# Altium project DUTBoard.PrjPcb (part 5 of 5)
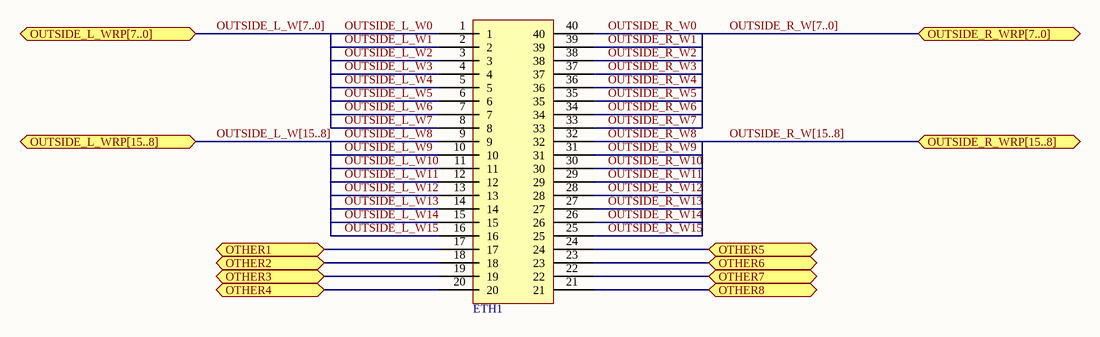
[diagram p15: BOTTOM_HEADER_WRP.SchDoc]

## Nets that join several sheets (continued)
OUTSIDE_L_W6: U_HEADER_BANK/U_COMBINED_HEADER_WRP/U_TOP_HEADER_WRP (TH2.7), U_HEADER_BANK/U_COMBINED_HEADER_WRP/U_BOTTOM_HEADER_WRP (ETH1_U_BOTTOM_HEADER_WRP1.7)
OUTSIDE_L_W7: U_HEADER_BANK/U_COMBINED_HEADER_WRP/U_TOP_HEADER_WRP (TH8.8), U_HEADER_BANK/U_COMBINED_HEADER_WRP/U_BOTTOM_HEADER_WRP (ETH1_U_BOTTOM_HEADER_WRP4.8)
OUTSIDE_L_W7: U_HEADER_BANK/U_COMBINED_HEADER_WRP/U_TOP_HEADER_WRP (TH6.8), U_HEADER_BANK/U_COMBINED_HEADER_WRP/U_BOTTOM_HEADER_WRP (ETH1_U_BOTTOM_HEADER_WRP3.8)
OUTSIDE_L_W7: U_HEADER_BANK/U_COMBINED_HEADER_WRP/U_TOP_HEADER_WRP (TH4.8), U_HEADER_BANK/U_COMBINED_HEADER_WRP/U_BOTTOM_HEADER_WRP (ETH1_U_BOTTOM_HEADER_WRP2.8)
OUTSIDE_L_W7: U_HEADER_BANK/U_COMBINED_HEADER_WRP/U_TOP_HEADER_WRP (TH2.8), U_HEADER_BANK/U_COMBINED_HEADER_WRP/U_BOTTOM_HEADER_WRP (ETH1_U_BOTTOM_HEADER_WRP1.8)
OUTSIDE_L_W8: U_HEADER_BANK/U_COMBINED_HEADER_WRP/U_TOP_HEADER_WRP (TH8.9), U_HEADER_BANK/U_COMBINED_HEADER_WRP/U_BOTTOM_HEADER_WRP (ETH1_U_BOTTOM_HEADER_WRP4.9)
OUTSIDE_L_W8: U_HEADER_BANK/U_COMBINED_HEADER_WRP/U_TOP_HEADER_WRP (TH6.9), U_HEADER_BANK/U_COMBINED_HEADER_WRP/U_BOTTOM_HEADER_WRP (ETH1_U_BOTTOM_HEADER_WRP3.9)
OUTSIDE_L_W8: U_HEADER_BANK/U_COMBINED_HEADER_WRP/U_TOP_HEADER_WRP (TH4.9), U_HEADER_BANK/U_COMBINED_HEADER_WRP/U_BOTTOM_HEADER_WRP (ETH1_U_BOTTOM_HEADER_WRP2.9)
OUTSIDE_L_W8: U_HEADER_BANK/U_COMBINED_HEADER_WRP/U_TOP_HEADER_WRP (TH2.9), U_HEADER_BANK/U_COMBINED_HEADER_WRP/U_BOTTOM_HEADER_WRP (ETH1_U_BOTTOM_HEADER_WRP1.9)
OUTSIDE_L_W9: U_HEADER_BANK/U_COMBINED_HEADER_WRP/U_TOP_HEADER_WRP (TH8.10), U_HEADER_BANK/U_COMBINED_HEADER_WRP/U_BOTTOM_HEADER_WRP (ETH1_U_BOTTOM_HEADER_WRP4.10)
OUTSIDE_L_W9: U_HEADER_BANK/U_COMBINED_HEADER_WRP/U_TOP_HEADER_WRP (TH6.10), U_HEADER_BANK/U_COMBINED_HEADER_WRP/U_BOTTOM_HEADER_WRP (ETH1_U_BOTTOM_HEADER_WRP3.10)
OUTSIDE_L_W9: U_HEADER_BANK/U_COMBINED_HEADER_WRP/U_TOP_HEADER_WRP (TH4.10), U_HEADER_BANK/U_COMBINED_HEADER_WRP/U_BOTTOM_HEADER_WRP (ETH1_U_BOTTOM_HEADER_WRP2.10)
OUTSIDE_L_W9: U_HEADER_BANK/U_COMBINED_HEADER_WRP/U_TOP_HEADER_WRP (TH2.10), U_HEADER_BANK/U_COMBINED_HEADER_WRP/U_BOTTOM_HEADER_WRP (ETH1_U_BOTTOM_HEADER_WRP1.10)
OUTSIDE_L_W10: U_HEADER_BANK/U_COMBINED_HEADER_WRP/U_TOP_HEADER_WRP (TH8.11), U_HEADER_BANK/U_COMBINED_HEADER_WRP/U_BOTTOM_HEADER_WRP (ETH1_U_BOTTOM_HEADER_WRP4.11)
OUTSIDE_L_W10: U_HEADER_BANK/U_COMBINED_HEADER_WRP/U_TOP_HEADER_WRP (TH6.11), U_HEADER_BANK/U_COMBINED_HEADER_WRP/U_BOTTOM_HEADER_WRP (ETH1_U_BOTTOM_HEADER_WRP3.11)
OUTSIDE_L_W10: U_HEADER_BANK/U_COMBINED_HEADER_WRP/U_TOP_HEADER_WRP (TH4.11), U_HEADER_BANK/U_COMBINED_HEADER_WRP/U_BOTTOM_HEADER_WRP (ETH1_U_BOTTOM_HEADER_WRP2.11)
OUTSIDE_L_W10: U_HEADER_BANK/U_COMBINED_HEADER_WRP/U_TOP_HEADER_WRP (TH2.11), U_HEADER_BANK/U_COMBINED_HEADER_WRP/U_BOTTOM_HEADER_WRP (ETH1_U_BOTTOM_HEADER_WRP1.11)
OUTSIDE_L_W11: U_HEADER_BANK/U_COMBINED_HEADER_WRP/U_TOP_HEADER_WRP (TH8.12), U_HEADER_BANK/U_COMBINED_HEADER_WRP/U_BOTTOM_HEADER_WRP (ETH1_U_BOTTOM_HEADER_WRP4.12)
OUTSIDE_L_W11: U_HEADER_BANK/U_COMBINED_HEADER_WRP/U_TOP_HEADER_WRP (TH6.12), U_HEADER_BANK/U_COMBINED_HEADER_WRP/U_BOTTOM_HEADER_WRP (ETH1_U_BOTTOM_HEADER_WRP3.12)
OUTSIDE_L_W11: U_HEADER_BANK/U_COMBINED_HEADER_WRP/U_TOP_HEADER_WRP (TH4.12), U_HEADER_BANK/U_COMBINED_HEADER_WRP/U_BOTTOM_HEADER_WRP (ETH1_U_BOTTOM_HEADER_WRP2.12)
OUTSIDE_L_W11: U_HEADER_BANK/U_COMBINED_HEADER_WRP/U_TOP_HEADER_WRP (TH2.12), U_HEADER_BANK/U_COMBINED_HEADER_WRP/U_BOTTOM_HEADER_WRP (ETH1_U_BOTTOM_HEADER_WRP1.12)
OUTSIDE_L_W12: U_HEADER_BANK/U_COMBINED_HEADER_WRP/U_TOP_HEADER_WRP (TH8.13), U_HEADER_BANK/U_COMBINED_HEADER_WRP/U_BOTTOM_HEADER_WRP (ETH1_U_BOTTOM_HEADER_WRP4.13)
OUTSIDE_L_W12: U_HEADER_BANK/U_COMBINED_HEADER_WRP/U_TOP_HEADER_WRP (TH6.13), U_HEADER_BANK/U_COMBINED_HEADER_WRP/U_BOTTOM_HEADER_WRP (ETH1_U_BOTTOM_HEADER_WRP3.13)
OUTSIDE_L_W12: U_HEADER_BANK/U_COMBINED_HEADER_WRP/U_TOP_HEADER_WRP (TH4.13), U_HEADER_BANK/U_COMBINED_HEADER_WRP/U_BOTTOM_HEADER_WRP (ETH1_U_BOTTOM_HEADER_WRP2.13)
OUTSIDE_L_W12: U_HEADER_BANK/U_COMBINED_HEADER_WRP/U_TOP_HEADER_WRP (TH2.13), U_HEADER_BANK/U_COMBINED_HEADER_WRP/U_BOTTOM_HEADER_WRP (ETH1_U_BOTTOM_HEADER_WRP1.13)
OUTSIDE_L_W13: U_HEADER_BANK/U_COMBINED_HEADER_WRP/U_TOP_HEADER_WRP (TH8.14), U_HEADER_BANK/U_COMBINED_HEADER_WRP/U_BOTTOM_HEADER_WRP (ETH1_U_BOTTOM_HEADER_WRP4.14)
OUTSIDE_L_W13: U_HEADER_BANK/U_COMBINED_HEADER_WRP/U_TOP_HEADER_WRP (TH6.14), U_HEADER_BANK/U_COMBINED_HEADER_WRP/U_BOTTOM_HEADER_WRP (ETH1_U_BOTTOM_HEADER_WRP3.14)
OUTSIDE_L_W13: U_HEADER_BANK/U_COMBINED_HEADER_WRP/U_TOP_HEADER_WRP (TH4.14), U_HEADER_BANK/U_COMBINED_HEADER_WRP/U_BOTTOM_HEADER_WRP (ETH1_U_BOTTOM_HEADER_WRP2.14)
OUTSIDE_L_W13: U_HEADER_BANK/U_COMBINED_HEADER_WRP/U_TOP_HEADER_WRP (TH2.14), U_HEADER_BANK/U_COMBINED_HEADER_WRP/U_BOTTOM_HEADER_WRP (ETH1_U_BOTTOM_HEADER_WRP1.14)
OUTSIDE_L_W14: U_HEADER_BANK/U_COMBINED_HEADER_WRP/U_TOP_HEADER_WRP (TH8.15), U_HEADER_BANK/U_COMBINED_HEADER_WRP/U_BOTTOM_HEADER_WRP (ETH1_U_BOTTOM_HEADER_WRP4.15)
OUTSIDE_L_W14: U_HEADER_BANK/U_COMBINED_HEADER_WRP/U_TOP_HEADER_WRP (TH6.15), U_HEADER_BANK/U_COMBINED_HEADER_WRP/U_BOTTOM_HEADER_WRP (ETH1_U_BOTTOM_HEADER_WRP3.15)
OUTSIDE_L_W14: U_HEADER_BANK/U_COMBINED_HEADER_WRP/U_TOP_HEADER_WRP (TH4.15), U_HEADER_BANK/U_COMBINED_HEADER_WRP/U_BOTTOM_HEADER_WRP (ETH1_U_BOTTOM_HEADER_WRP2.15)
OUTSIDE_L_W14: U_HEADER_BANK/U_COMBINED_HEADER_WRP/U_TOP_HEADER_WRP (TH2.15), U_HEADER_BANK/U_COMBINED_HEADER_WRP/U_BOTTOM_HEADER_WRP (ETH1_U_BOTTOM_HEADER_WRP1.15)
OUTSIDE_L_W15: U_HEADER_BANK/U_COMBINED_HEADER_WRP/U_TOP_HEADER_WRP (TH8.16), U_HEADER_BANK/U_COMBINED_HEADER_WRP/U_BOTTOM_HEADER_WRP (ETH1_U_BOTTOM_HEADER_WRP4.16)
OUTSIDE_L_W15: U_HEADER_BANK/U_COMBINED_HEADER_WRP/U_TOP_HEADER_WRP (TH6.16), U_HEADER_BANK/U_COMBINED_HEADER_WRP/U_BOTTOM_HEADER_WRP (ETH1_U_BOTTOM_HEADER_WRP3.16)
OUTSIDE_L_W15: U_HEADER_BANK/U_COMBINED_HEADER_WRP/U_TOP_HEADER_WRP (TH4.16), U_HEADER_BANK/U_COMBINED_HEADER_WRP/U_BOTTOM_HEADER_WRP (ETH1_U_BOTTOM_HEADER_WRP2.16)
OUTSIDE_L_W15: U_HEADER_BANK/U_COMBINED_HEADER_WRP/U_TOP_HEADER_WRP (TH2.16), U_HEADER_BANK/U_COMBINED_HEADER_WRP/U_BOTTOM_HEADER_WRP (ETH1_U_BOTTOM_HEADER_WRP1.16)
OUTSIDE_R_W0: U_HEADER_BANK/U_COMBINED_HEADER_WRP/U_TOP_HEADER_WRP (TH7.1), U_HEADER_BANK/U_COMBINED_HEADER_WRP/U_BOTTOM_HEADER_WRP (ETH1_U_BOTTOM_HEADER_WRP4.40)
OUTSIDE_R_W0: U_HEADER_BANK/U_COMBINED_HEADER_WRP/U_TOP_HEADER_WRP (TH5.1), U_HEADER_BANK/U_COMBINED_HEADER_WRP/U_BOTTOM_HEADER_WRP (ETH1_U_BOTTOM_HEADER_WRP3.40)
OUTSIDE_R_W0: U_HEADER_BANK/U_COMBINED_HEADER_WRP/U_TOP_HEADER_WRP (TH3#1.1), U_HEADER_BANK/U_COMBINED_HEADER_WRP/U_BOTTOM_HEADER_WRP (ETH1_U_BOTTOM_HEADER_WRP2.40)
OUTSIDE_R_W0: U_HEADER_BANK/U_COMBINED_HEADER_WRP/U_TOP_HEADER_WRP (TH3#2.1), U_HEADER_BANK/U_COMBINED_HEADER_WRP/U_BOTTOM_HEADER_WRP (ETH1_U_BOTTOM_HEADER_WRP1.40)
OUTSIDE_R_W1: U_HEADER_BANK/U_COMBINED_HEADER_WRP/U_TOP_HEADER_WRP (TH7.2), U_HEADER_BANK/U_COMBINED_HEADER_WRP/U_BOTTOM_HEADER_WRP (ETH1_U_BOTTOM_HEADER_WRP4.39)
OUTSIDE_R_W1: U_HEADER_BANK/U_COMBINED_HEADER_WRP/U_TOP_HEADER_WRP (TH5.2), U_HEADER_BANK/U_COMBINED_HEADER_WRP/U_BOTTOM_HEADER_WRP (ETH1_U_BOTTOM_HEADER_WRP3.39)
OUTSIDE_R_W1: U_HEADER_BANK/U_COMBINED_HEADER_WRP/U_TOP_HEADER_WRP (TH3#1.2), U_HEADER_BANK/U_COMBINED_HEADER_WRP/U_BOTTOM_HEADER_WRP (ETH1_U_BOTTOM_HEADER_WRP2.39)
OUTSIDE_R_W1: U_HEADER_BANK/U_COMBINED_HEADER_WRP/U_TOP_HEADER_WRP (TH3#2.2), U_HEADER_BANK/U_COMBINED_HEADER_WRP/U_BOTTOM_HEADER_WRP (ETH1_U_BOTTOM_HEADER_WRP1.39)
OUTSIDE_R_W2: U_HEADER_BANK/U_COMBINED_HEADER_WRP/U_TOP_HEADER_WRP (TH7.3), U_HEADER_BANK/U_COMBINED_HEADER_WRP/U_BOTTOM_HEADER_WRP (ETH1_U_BOTTOM_HEADER_WRP4.38)
OUTSIDE_R_W2: U_HEADER_BANK/U_COMBINED_HEADER_WRP/U_TOP_HEADER_WRP (TH5.3), U_HEADER_BANK/U_COMBINED_HEADER_WRP/U_BOTTOM_HEADER_WRP (ETH1_U_BOTTOM_HEADER_WRP3.38)
OUTSIDE_R_W2: U_HEADER_BANK/U_COMBINED_HEADER_WRP/U_TOP_HEADER_WRP (TH3#1.3), U_HEADER_BANK/U_COMBINED_HEADER_WRP/U_BOTTOM_HEADER_WRP (ETH1_U_BOTTOM_HEADER_WRP2.38)
OUTSIDE_R_W2: U_HEADER_BANK/U_COMBINED_HEADER_WRP/U_TOP_HEADER_WRP (TH3#2.3), U_HEADER_BANK/U_COMBINED_HEADER_WRP/U_BOTTOM_HEADER_WRP (ETH1_U_BOTTOM_HEADER_WRP1.38)
OUTSIDE_R_W3: U_HEADER_BANK/U_COMBINED_HEADER_WRP/U_TOP_HEADER_WRP (TH7.4), U_HEADER_BANK/U_COMBINED_HEADER_WRP/U_BOTTOM_HEADER_WRP (ETH1_U_BOTTOM_HEADER_WRP4.37)
OUTSIDE_R_W3: U_HEADER_BANK/U_COMBINED_HEADER_WRP/U_TOP_HEADER_WRP (TH5.4), U_HEADER_BANK/U_COMBINED_HEADER_WRP/U_BOTTOM_HEADER_WRP (ETH1_U_BOTTOM_HEADER_WRP3.37)
OUTSIDE_R_W3: U_HEADER_BANK/U_COMBINED_HEADER_WRP/U_TOP_HEADER_WRP (TH3#1.4), U_HEADER_BANK/U_COMBINED_HEADER_WRP/U_BOTTOM_HEADER_WRP (ETH1_U_BOTTOM_HEADER_WRP2.37)
OUTSIDE_R_W3: U_HEADER_BANK/U_COMBINED_HEADER_WRP/U_TOP_HEADER_WRP (TH3#2.4), U_HEADER_BANK/U_COMBINED_HEADER_WRP/U_BOTTOM_HEADER_WRP (ETH1_U_BOTTOM_HEADER_WRP1.37)
OUTSIDE_R_W4: U_HEADER_BANK/U_COMBINED_HEADER_WRP/U_TOP_HEADER_WRP (TH7.5), U_HEADER_BANK/U_COMBINED_HEADER_WRP/U_BOTTOM_HEADER_WRP (ETH1_U_BOTTOM_HEADER_WRP4.36)
OUTSIDE_R_W4: U_HEADER_BANK/U_COMBINED_HEADER_WRP/U_TOP_HEADER_WRP (TH5.5), U_HEADER_BANK/U_COMBINED_HEADER_WRP/U_BOTTOM_HEADER_WRP (ETH1_U_BOTTOM_HEADER_WRP3.36)
OUTSIDE_R_W4: U_HEADER_BANK/U_COMBINED_HEADER_WRP/U_TOP_HEADER_WRP (TH3#1.5), U_HEADER_BANK/U_COMBINED_HEADER_WRP/U_BOTTOM_HEADER_WRP (ETH1_U_BOTTOM_HEADER_WRP2.36)
OUTSIDE_R_W4: U_HEADER_BANK/U_COMBINED_HEADER_WRP/U_TOP_HEADER_WRP (TH3#2.5), U_HEADER_BANK/U_COMBINED_HEADER_WRP/U_BOTTOM_HEADER_WRP (ETH1_U_BOTTOM_HEADER_WRP1.36)
OUTSIDE_R_W5: U_HEADER_BANK/U_COMBINED_HEADER_WRP/U_TOP_HEADER_WRP (TH7.6), U_HEADER_BANK/U_COMBINED_HEADER_WRP/U_BOTTOM_HEADER_WRP (ETH1_U_BOTTOM_HEADER_WRP4.35)
OUTSIDE_R_W5: U_HEADER_BANK/U_COMBINED_HEADER_WRP/U_TOP_HEADER_WRP (TH5.6), U_HEADER_BANK/U_COMBINED_HEADER_WRP/U_BOTTOM_HEADER_WRP (ETH1_U_BOTTOM_HEADER_WRP3.35)
OUTSIDE_R_W5: U_HEADER_BANK/U_COMBINED_HEADER_WRP/U_TOP_HEADER_WRP (TH3#1.6), U_HEADER_BANK/U_COMBINED_HEADER_WRP/U_BOTTOM_HEADER_WRP (ETH1_U_BOTTOM_HEADER_WRP2.35)
OUTSIDE_R_W5: U_HEADER_BANK/U_COMBINED_HEADER_WRP/U_TOP_HEADER_WRP (TH3#2.6), U_HEADER_BANK/U_COMBINED_HEADER_WRP/U_BOTTOM_HEADER_WRP (ETH1_U_BOTTOM_HEADER_WRP1.35)
OUTSIDE_R_W6: U_HEADER_BANK/U_COMBINED_HEADER_WRP/U_TOP_HEADER_WRP (TH7.7), U_HEADER_BANK/U_COMBINED_HEADER_WRP/U_BOTTOM_HEADER_WRP (ETH1_U_BOTTOM_HEADER_WRP4.34)
OUTSIDE_R_W6: U_HEADER_BANK/U_COMBINED_HEADER_WRP/U_TOP_HEADER_WRP (TH5.7), U_HEADER_BANK/U_COMBINED_HEADER_WRP/U_BOTTOM_HEADER_WRP (ETH1_U_BOTTOM_HEADER_WRP3.34)
OUTSIDE_R_W6: U_HEADER_BANK/U_COMBINED_HEADER_WRP/U_TOP_HEADER_WRP (TH3#1.7), U_HEADER_BANK/U_COMBINED_HEADER_WRP/U_BOTTOM_HEADER_WRP (ETH1_U_BOTTOM_HEADER_WRP2.34)
OUTSIDE_R_W6: U_HEADER_BANK/U_COMBINED_HEADER_WRP/U_TOP_HEADER_WRP (TH3#2.7), U_HEADER_BANK/U_COMBINED_HEADER_WRP/U_BOTTOM_HEADER_WRP (ETH1_U_BOTTOM_HEADER_WRP1.34)
OUTSIDE_R_W7: U_HEADER_BANK/U_COMBINED_HEADER_WRP/U_TOP_HEADER_WRP (TH7.8), U_HEADER_BANK/U_COMBINED_HEADER_WRP/U_BOTTOM_HEADER_WRP (ETH1_U_BOTTOM_HEADER_WRP4.33)
OUTSIDE_R_W7: U_HEADER_BANK/U_COMBINED_HEADER_WRP/U_TOP_HEADER_WRP (TH5.8), U_HEADER_BANK/U_COMBINED_HEADER_WRP/U_BOTTOM_HEADER_WRP (ETH1_U_BOTTOM_HEADER_WRP3.33)
OUTSIDE_R_W7: U_HEADER_BANK/U_COMBINED_HEADER_WRP/U_TOP_HEADER_WRP (TH3#1.8), U_HEADER_BANK/U_COMBINED_HEADER_WRP/U_BOTTOM_HEADER_WRP (ETH1_U_BOTTOM_HEADER_WRP2.33)
OUTSIDE_R_W7: U_HEADER_BANK/U_COMBINED_HEADER_WRP/U_TOP_HEADER_WRP (TH3#2.8), U_HEADER_BANK/U_COMBINED_HEADER_WRP/U_BOTTOM_HEADER_WRP (ETH1_U_BOTTOM_HEADER_WRP1.33)
OUTSIDE_R_W8: U_HEADER_BANK/U_COMBINED_HEADER_WRP/U_TOP_HEADER_WRP (TH7.9), U_HEADER_BANK/U_COMBINED_HEADER_WRP/U_BOTTOM_HEADER_WRP (ETH1_U_BOTTOM_HEADER_WRP4.32)
OUTSIDE_R_W8: U_HEADER_BANK/U_COMBINED_HEADER_WRP/U_TOP_HEADER_WRP (TH5.9), U_HEADER_BANK/U_COMBINED_HEADER_WRP/U_BOTTOM_HEADER_WRP (ETH1_U_BOTTOM_HEADER_WRP3.32)
OUTSIDE_R_W8: U_HEADER_BANK/U_COMBINED_HEADER_WRP/U_TOP_HEADER_WRP (TH3#1.9), U_HEADER_BANK/U_COMBINED_HEADER_WRP/U_BOTTOM_HEADER_WRP (ETH1_U_BOTTOM_HEADER_WRP2.32)
OUTSIDE_R_W8: U_HEADER_BANK/U_COMBINED_HEADER_WRP/U_TOP_HEADER_WRP (TH3#2.9), U_HEADER_BANK/U_COMBINED_HEADER_WRP/U_BOTTOM_HEADER_WRP (ETH1_U_BOTTOM_HEADER_WRP1.32)
OUTSIDE_R_W9: U_HEADER_BANK/U_COMBINED_HEADER_WRP/U_TOP_HEADER_WRP (TH7.10), U_HEADER_BANK/U_COMBINED_HEADER_WRP/U_BOTTOM_HEADER_WRP (ETH1_U_BOTTOM_HEADER_WRP4.31)
OUTSIDE_R_W9: U_HEADER_BANK/U_COMBINED_HEADER_WRP/U_TOP_HEADER_WRP (TH5.10), U_HEADER_BANK/U_COMBINED_HEADER_WRP/U_BOTTOM_HEADER_WRP (ETH1_U_BOTTOM_HEADER_WRP3.31)
OUTSIDE_R_W9: U_HEADER_BANK/U_COMBINED_HEADER_WRP/U_TOP_HEADER_WRP (TH3#1.10), U_HEADER_BANK/U_COMBINED_HEADER_WRP/U_BOTTOM_HEADER_WRP (ETH1_U_BOTTOM_HEADER_WRP2.31)
OUTSIDE_R_W9: U_HEADER_BANK/U_COMBINED_HEADER_WRP/U_TOP_HEADER_WRP (TH3#2.10), U_HEADER_BANK/U_COMBINED_HEADER_WRP/U_BOTTOM_HEADER_WRP (ETH1_U_BOTTOM_HEADER_WRP1.31)
OUTSIDE_R_W10: U_HEADER_BANK/U_COMBINED_HEADER_WRP/U_TOP_HEADER_WRP (TH7.11), U_HEADER_BANK/U_COMBINED_HEADER_WRP/U_BOTTOM_HEADER_WRP (ETH1_U_BOTTOM_HEADER_WRP4.30)
OUTSIDE_R_W10: U_HEADER_BANK/U_COMBINED_HEADER_WRP/U_TOP_HEADER_WRP (TH5.11), U_HEADER_BANK/U_COMBINED_HEADER_WRP/U_BOTTOM_HEADER_WRP (ETH1_U_BOTTOM_HEADER_WRP3.30)
OUTSIDE_R_W10: U_HEADER_BANK/U_COMBINED_HEADER_WRP/U_TOP_HEADER_WRP (TH3#1.11), U_HEADER_BANK/U_COMBINED_HEADER_WRP/U_BOTTOM_HEADER_WRP (ETH1_U_BOTTOM_HEADER_WRP2.30)
OUTSIDE_R_W10: U_HEADER_BANK/U_COMBINED_HEADER_WRP/U_TOP_HEADER_WRP (TH3#2.11), U_HEADER_BANK/U_COMBINED_HEADER_WRP/U_BOTTOM_HEADER_WRP (ETH1_U_BOTTOM_HEADER_WRP1.30)
OUTSIDE_R_W11: U_HEADER_BANK/U_COMBINED_HEADER_WRP/U_TOP_HEADER_WRP (TH7.12), U_HEADER_BANK/U_COMBINED_HEADER_WRP/U_BOTTOM_HEADER_WRP (ETH1_U_BOTTOM_HEADER_WRP4.29)
OUTSIDE_R_W11: U_HEADER_BANK/U_COMBINED_HEADER_WRP/U_TOP_HEADER_WRP (TH5.12), U_HEADER_BANK/U_COMBINED_HEADER_WRP/U_BOTTOM_HEADER_WRP (ETH1_U_BOTTOM_HEADER_WRP3.29)
OUTSIDE_R_W11: U_HEADER_BANK/U_COMBINED_HEADER_WRP/U_TOP_HEADER_WRP (TH3#1.12), U_HEADER_BANK/U_COMBINED_HEADER_WRP/U_BOTTOM_HEADER_WRP (ETH1_U_BOTTOM_HEADER_WRP2.29)
OUTSIDE_R_W11: U_HEADER_BANK/U_COMBINED_HEADER_WRP/U_TOP_HEADER_WRP (TH3#2.12), U_HEADER_BANK/U_COMBINED_HEADER_WRP/U_BOTTOM_HEADER_WRP (ETH1_U_BOTTOM_HEADER_WRP1.29)
OUTSIDE_R_W12: U_HEADER_BANK/U_COMBINED_HEADER_WRP/U_TOP_HEADER_WRP (TH7.13), U_HEADER_BANK/U_COMBINED_HEADER_WRP/U_BOTTOM_HEADER_WRP (ETH1_U_BOTTOM_HEADER_WRP4.28)
OUTSIDE_R_W12: U_HEADER_BANK/U_COMBINED_HEADER_WRP/U_TOP_HEADER_WRP (TH5.13), U_HEADER_BANK/U_COMBINED_HEADER_WRP/U_BOTTOM_HEADER_WRP (ETH1_U_BOTTOM_HEADER_WRP3.28)
OUTSIDE_R_W12: U_HEADER_BANK/U_COMBINED_HEADER_WRP/U_TOP_HEADER_WRP (TH3#1.13), U_HEADER_BANK/U_COMBINED_HEADER_WRP/U_BOTTOM_HEADER_WRP (ETH1_U_BOTTOM_HEADER_WRP2.28)
OUTSIDE_R_W12: U_HEADER_BANK/U_COMBINED_HEADER_WRP/U_TOP_HEADER_WRP (TH3#2.13), U_HEADER_BANK/U_COMBINED_HEADER_WRP/U_BOTTOM_HEADER_WRP (ETH1_U_BOTTOM_HEADER_WRP1.28)
OUTSIDE_R_W13: U_HEADER_BANK/U_COMBINED_HEADER_WRP/U_TOP_HEADER_WRP (TH7.14), U_HEADER_BANK/U_COMBINED_HEADER_WRP/U_BOTTOM_HEADER_WRP (ETH1_U_BOTTOM_HEADER_WRP4.27)
OUTSIDE_R_W13: U_HEADER_BANK/U_COMBINED_HEADER_WRP/U_TOP_HEADER_WRP (TH5.14), U_HEADER_BANK/U_COMBINED_HEADER_WRP/U_BOTTOM_HEADER_WRP (ETH1_U_BOTTOM_HEADER_WRP3.27)
OUTSIDE_R_W13: U_HEADER_BANK/U_COMBINED_HEADER_WRP/U_TOP_HEADER_WRP (TH3#1.14), U_HEADER_BANK/U_COMBINED_HEADER_WRP/U_BOTTOM_HEADER_WRP (ETH1_U_BOTTOM_HEADER_WRP2.27)
OUTSIDE_R_W13: U_HEADER_BANK/U_COMBINED_HEADER_WRP/U_TOP_HEADER_WRP (TH3#2.14), U_HEADER_BANK/U_COMBINED_HEADER_WRP/U_BOTTOM_HEADER_WRP (ETH1_U_BOTTOM_HEADER_WRP1.27)
OUTSIDE_R_W14: U_HEADER_BANK/U_COMBINED_HEADER_WRP/U_TOP_HEADER_WRP (TH7.15), U_HEADER_BANK/U_COMBINED_HEADER_WRP/U_BOTTOM_HEADER_WRP (ETH1_U_BOTTOM_HEADER_WRP4.26)
OUTSIDE_R_W14: U_HEADER_BANK/U_COMBINED_HEADER_WRP/U_TOP_HEADER_WRP (TH5.15), U_HEADER_BANK/U_COMBINED_HEADER_WRP/U_BOTTOM_HEADER_WRP (ETH1_U_BOTTOM_HEADER_WRP3.26)
OUTSIDE_R_W14: U_HEADER_BANK/U_COMBINED_HEADER_WRP/U_TOP_HEADER_WRP (TH3#1.15), U_HEADER_BANK/U_COMBINED_HEADER_WRP/U_BOTTOM_HEADER_WRP (ETH1_U_BOTTOM_HEADER_WRP2.26)
OUTSIDE_R_W14: U_HEADER_BANK/U_COMBINED_HEADER_WRP/U_TOP_HEADER_WRP (TH3#2.15), U_HEADER_BANK/U_COMBINED_HEADER_WRP/U_BOTTOM_HEADER_WRP (ETH1_U_BOTTOM_HEADER_WRP1.26)
OUTSIDE_R_W15: U_HEADER_BANK/U_COMBINED_HEADER_WRP/U_TOP_HEADER_WRP (TH7.16), U_HEADER_BANK/U_COMBINED_HEADER_WRP/U_BOTTOM_HEADER_WRP (ETH1_U_BOTTOM_HEADER_WRP4.25)
OUTSIDE_R_W15: U_HEADER_BANK/U_COMBINED_HEADER_WRP/U_TOP_HEADER_WRP (TH5.16), U_HEADER_BANK/U_COMBINED_HEADER_WRP/U_BOTTOM_HEADER_WRP (ETH1_U_BOTTOM_HEADER_WRP3.25)
OUTSIDE_R_W15: U_HEADER_BANK/U_COMBINED_HEADER_WRP/U_TOP_HEADER_WRP (TH3#1.16), U_HEADER_BANK/U_COMBINED_HEADER_WRP/U_BOTTOM_HEADER_WRP (ETH1_U_BOTTOM_HEADER_WRP2.25)
OUTSIDE_R_W15: U_HEADER_BANK/U_COMBINED_HEADER_WRP/U_TOP_HEADER_WRP (TH3#2.16), U_HEADER_BANK/U_COMBINED_HEADER_WRP/U_BOTTOM_HEADER_WRP (ETH1_U_BOTTOM_HEADER_WRP1.25)
SER0: U_OB_BANK/U_OB_WRP (OB16.Q), U_OB_BANK/U_OB_WRP (OB15.DS)
SER1: U_OB_BANK/U_OB_WRP (OB15.Q), U_OB_BANK/U_OB_WRP (OB14.DS)
SER2: U_OB_BANK/U_OB_WRP (OB14.Q), U_OB_BANK/U_OB_WRP (OB13.DS)
SER3: U_OB_BANK/U_OB_WRP (OB13.Q), U_OB_BANK/U_OB_WRP (OB12.DS)
SER4: U_OB_BANK/U_OB_WRP (OB12.Q), U_OB_BANK/U_OB_WRP (OB11.DS)
SER5: U_OB_BANK/U_OB_WRP (OB11.Q), U_OB_BANK/U_OB_WRP (OB10.DS)
SER6: U_OB_BANK/U_OB_WRP (OB10.Q), U_OB_BANK/U_OB_WRP (OB9.DS)
SER7: U_OB_BANK/U_OB_WRP (OB9.Q), U_OB_BANK/U_OB_WRP (OB8.DS)
SER8: U_OB_BANK/U_OB_WRP (OB8.Q), U_OB_BANK/U_OB_WRP (OB7.DS)
SER9: U_OB_BANK/U_OB_WRP (OB7.Q), U_OB_BANK/U_OB_WRP (OB6.DS)
SER10: U_OB_BANK/U_OB_WRP (OB6.Q), U_OB_BANK/U_OB_WRP (OB5.DS)
SER11: U_OB_BANK/U_OB_WRP (OB5.Q), U_OB_BANK/U_OB_WRP (OB4.DS)
SER12: U_OB_BANK/U_OB_WRP (OB4.Q), U_OB_BANK/U_OB_WRP (OB3.DS)
SER13: U_OB_BANK/U_OB_WRP (OB3.Q), U_OB_BANK/U_OB_WRP (OB2.DS)
SER14: U_OB_BANK/U_OB_WRP (OB2.Q), U_OB_BANK/U_OB_WRP (OB1.DS)